# Altium schematic sheet RS232.SchDoc
size A; SheetNumber: 4; SheetTotal: 7
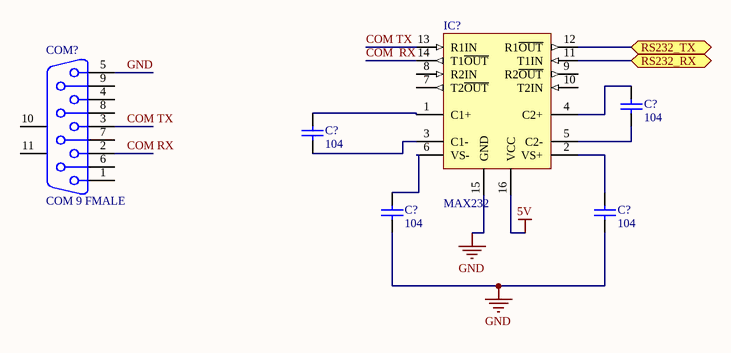
[diagram p0: RS232.SchDoc]

## Parts
(Parts that share a designator on the sheet are numbered #1, #2 ... from top to bottom, then left to right.)
C?#1  104  [tu 0805]
C?#2  104  [tu 0805]
C?#3  104  [tu 0805]
C?#4  104  [tu 0805]
COM?  COM 9 FMALE  [DSB 9-F]
IC?  MAX232  [DIP16/W0.3]

## Ports
RS232_RX (bidir), RS232_TX (bidir)

## Nets
5V: IC?.16(VCC)
GND: C?#3.2 C?#4.2 COM?.5 IC?.15(GND)
COM  RX: IC?.14(T1~{OUT})
COM RX: COM?.2
COM TX: COM?.3 IC?.13(R1IN)
RS232_RX: IC?.11(T1IN) ; port RS232_RX
RS232_TX: IC?.12(R1~{OUT}) ; port RS232_TX
NetC?#1_1: C?#1.1 IC?.4(C2+)
NetC?#1_2: C?#1.2 IC?.5(C2-)
NetC?#2_1: C?#2.1 IC?.1(C1+)
NetC?#2_2: C?#2.2 IC?.3(C1-)
NetC?#3_1: C?#3.1 IC?.6(VS-)
NetC?#4_1: C?#4.1 IC?.2(VS+)

Not connected (* = marked no-connect by the designer): COM? 1 4 6 7 8 9 10(MH1) 11(MH2); IC? 7(T2~{OUT}) 8(R2IN) 9(R2~{OUT}) 10(T2IN)

## Library data of the parts
C?#1-C?#4 = Tu 0805 104 50V 10%: Dán; Don_Vi: Con; So_Chan: 2; Ten_Linh_Kien: Tụ 0805 104-100nF 10% 50V; Ma_Hang: MH004551; Chung_Loai: Dán; Kieu_Chan: *
COM? = DSB9F: COM 9; PackageDocument: O; Positions: 9; Gender: Receptacle; Value: COM 9; Published: 15-Jun-2001; LatestRevisionDate: 17-Jul-2002; LatestRevisionNote: Re-released for DXP Platform.; DatasheetDocument: 1-Sep-1999; PackageReference: 788750; Publisher: Altium Limited; Orientation: Right Angle
IC? = MAX232: Dual EIA-232 Driver/Receiver; Value: MAX232